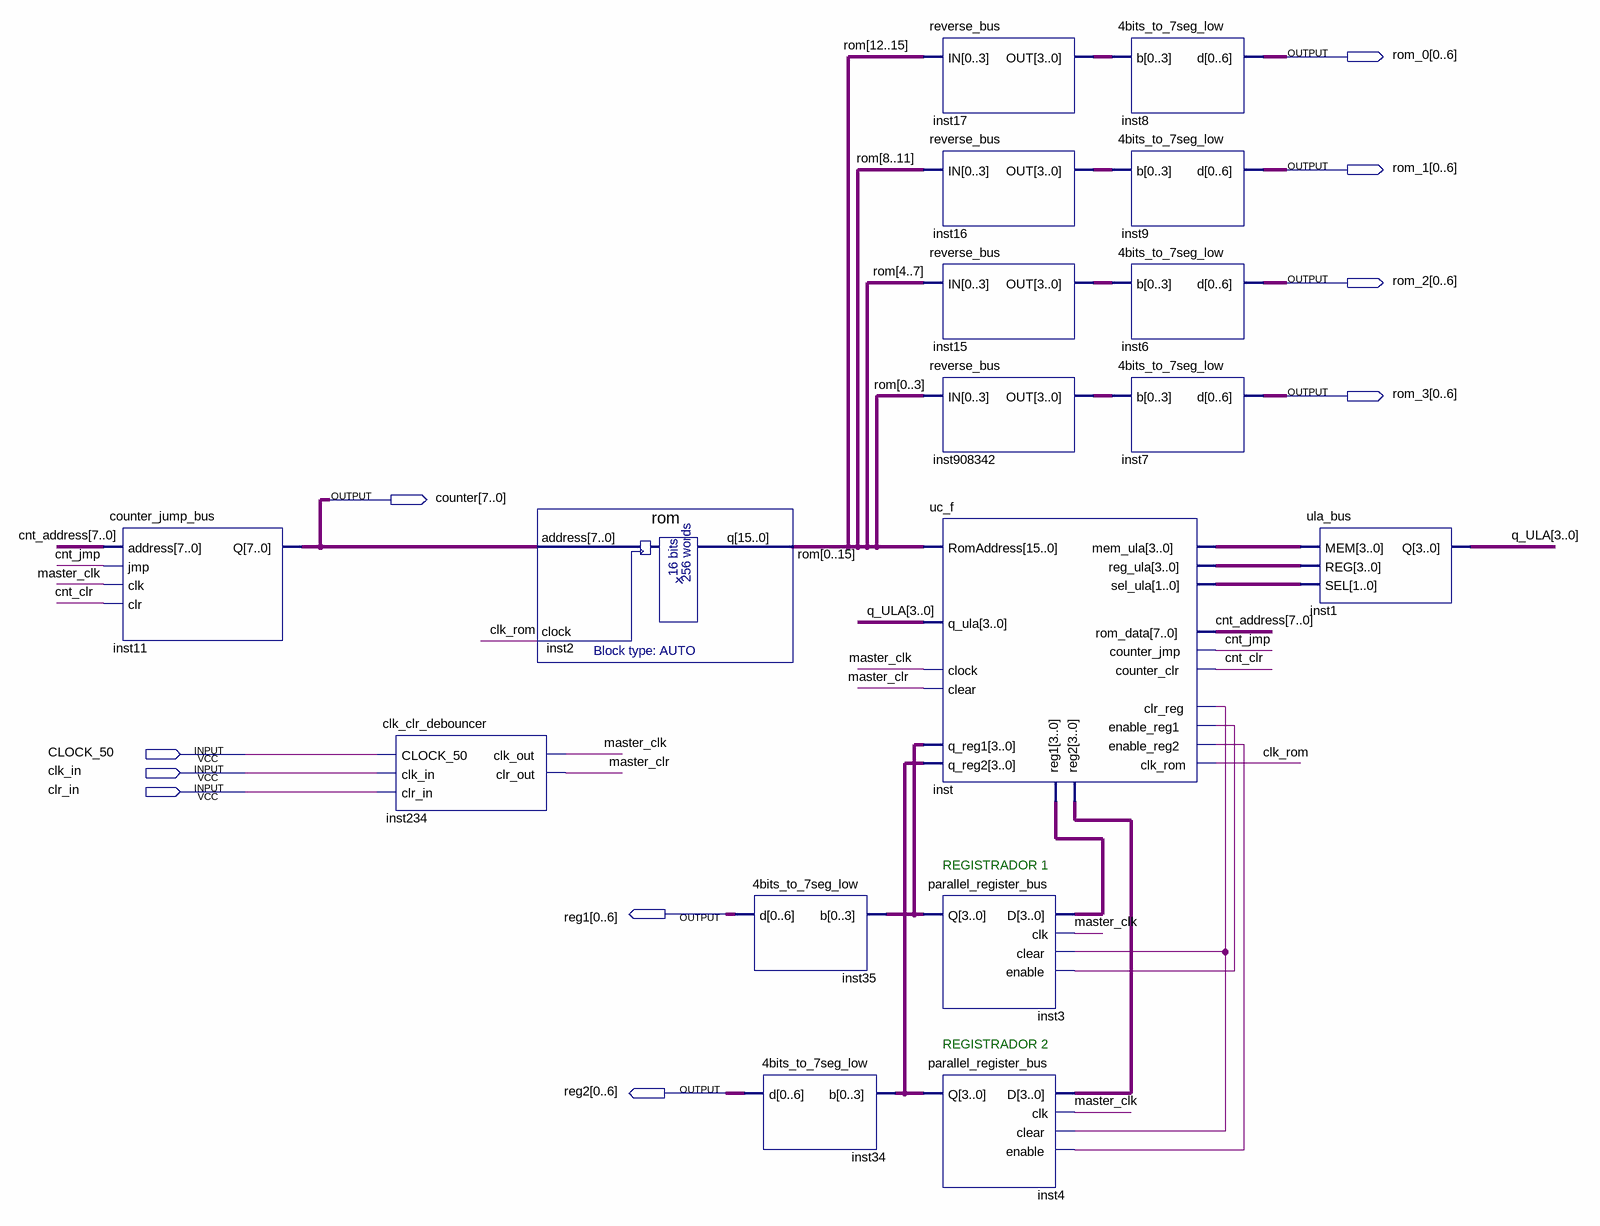
[diagram p0: schematic sheet]
// Quartus schematic cpu_f.bdf as structural Verilog: 17 symbols, 10 pins
module cpu_f (
  input  CLOCK_50,
  input  clk_in,
  input  clr_in,
  output [0:6] rom_0,
  output [0:6] rom_1,
  output [0:6] rom_2,
  output [0:6] rom_3,
  output [7:0] counter,
  output [0:6] reg1,
  output [0:6] reg2
);

  wire clk_rom, cnt_clr, cnt_jmp, inst_clr_reg, inst_enable_reg1, inst_enable_reg2, master_clk, master_clr;
  wire [1:0] inst_sel_ula;
  wire [3:0] inst3_q, inst4_q, inst15_out, inst16_out, inst17_out, inst908342_out, inst_mem_ula, inst_reg1,
       inst_reg2, inst_reg_ula, q_ULA;
  wire [7:0] cnt_address;
  wire [15:0] rom;

  counter_jump_bus inst11 (.address(cnt_address), .jmp(cnt_jmp), .clk(master_clk), .clr(cnt_clr), .Q(counter));
  clk_clr_debouncer inst234 (
    .CLOCK_50(CLOCK_50), .clk_in(clk_in), .clr_in(clr_in), .clk_out(master_clk), .clr_out(master_clr));
  rom inst2 (
    .address(counter), .clock(clk_rom),
    .q({rom[0], rom[1], rom[2], rom[3], rom[4], rom[5], rom[6], rom[7], rom[8], rom[9], rom[10], rom[11], rom[12], rom[13], rom[14], rom[15]}));
  \4bits_to_7seg_low  inst35 (.b(inst3_q), .d(reg1));
  \4bits_to_7seg_low  inst34 (.b(inst4_q), .d(reg2));
  reverse_bus inst17 (.IN({rom[12], rom[13], rom[14], rom[15]}), .OUT(inst17_out));
  reverse_bus inst16 (.IN({rom[8], rom[9], rom[10], rom[11]}), .OUT(inst16_out));
  reverse_bus inst15 (.IN({rom[4], rom[5], rom[6], rom[7]}), .OUT(inst15_out));
  reverse_bus inst908342 (.IN({rom[0], rom[1], rom[2], rom[3]}), .OUT(inst908342_out));
  uc_f inst (
    .q_reg1(inst3_q), .q_reg2(inst4_q), .clock(master_clk), .q_ula(q_ULA), .clear(master_clr),
    .RomAddress({rom[0], rom[1], rom[2], rom[3], rom[4], rom[5], rom[6], rom[7], rom[8], rom[9], rom[10], rom[11], rom[12], rom[13], rom[14], rom[15]}),
    .reg_ula(inst_reg_ula), .clk_rom(clk_rom), .reg2(inst_reg2), .reg1(inst_reg1), .clr_reg(inst_clr_reg),
    .sel_ula(inst_sel_ula), .counter_jmp(cnt_jmp), .rom_data(cnt_address), .counter_clr(cnt_clr),
    .enable_reg1(inst_enable_reg1), .enable_reg2(inst_enable_reg2), .mem_ula(inst_mem_ula));
  parallel_register_bus inst3 (
    .D(inst_reg1), .clk(master_clk), .clear(inst_clr_reg), .enable(inst_enable_reg1), .Q(inst3_q));
  parallel_register_bus inst4 (
    .D(inst_reg2), .clk(master_clk), .clear(inst_clr_reg), .enable(inst_enable_reg2), .Q(inst4_q));
  \4bits_to_7seg_low  inst8 (.b(inst17_out), .d(rom_0));
  \4bits_to_7seg_low  inst9 (.b(inst16_out), .d(rom_1));
  \4bits_to_7seg_low  inst6 (.b(inst15_out), .d(rom_2));
  \4bits_to_7seg_low  inst7 (.b(inst908342_out), .d(rom_3));
  ula_bus inst1 (.MEM(inst_mem_ula), .REG(inst_reg_ula), .SEL(inst_sel_ula), .Q(q_ULA));

  // Notes on the sheet:
  //   REGISTRADOR 1
  //   REGISTRADOR 2
endmodule
